# EasyEDA Pro project ORECON_REV1.0.eprj

# Schematic 0:Main
Create Date: 2024-05-21; Page Name: P1; Project Name: ORECON; Schematic Name: 0:Main; Update Date: 2024-05-22; Add into BOM: yes; Convert to PCB: yes
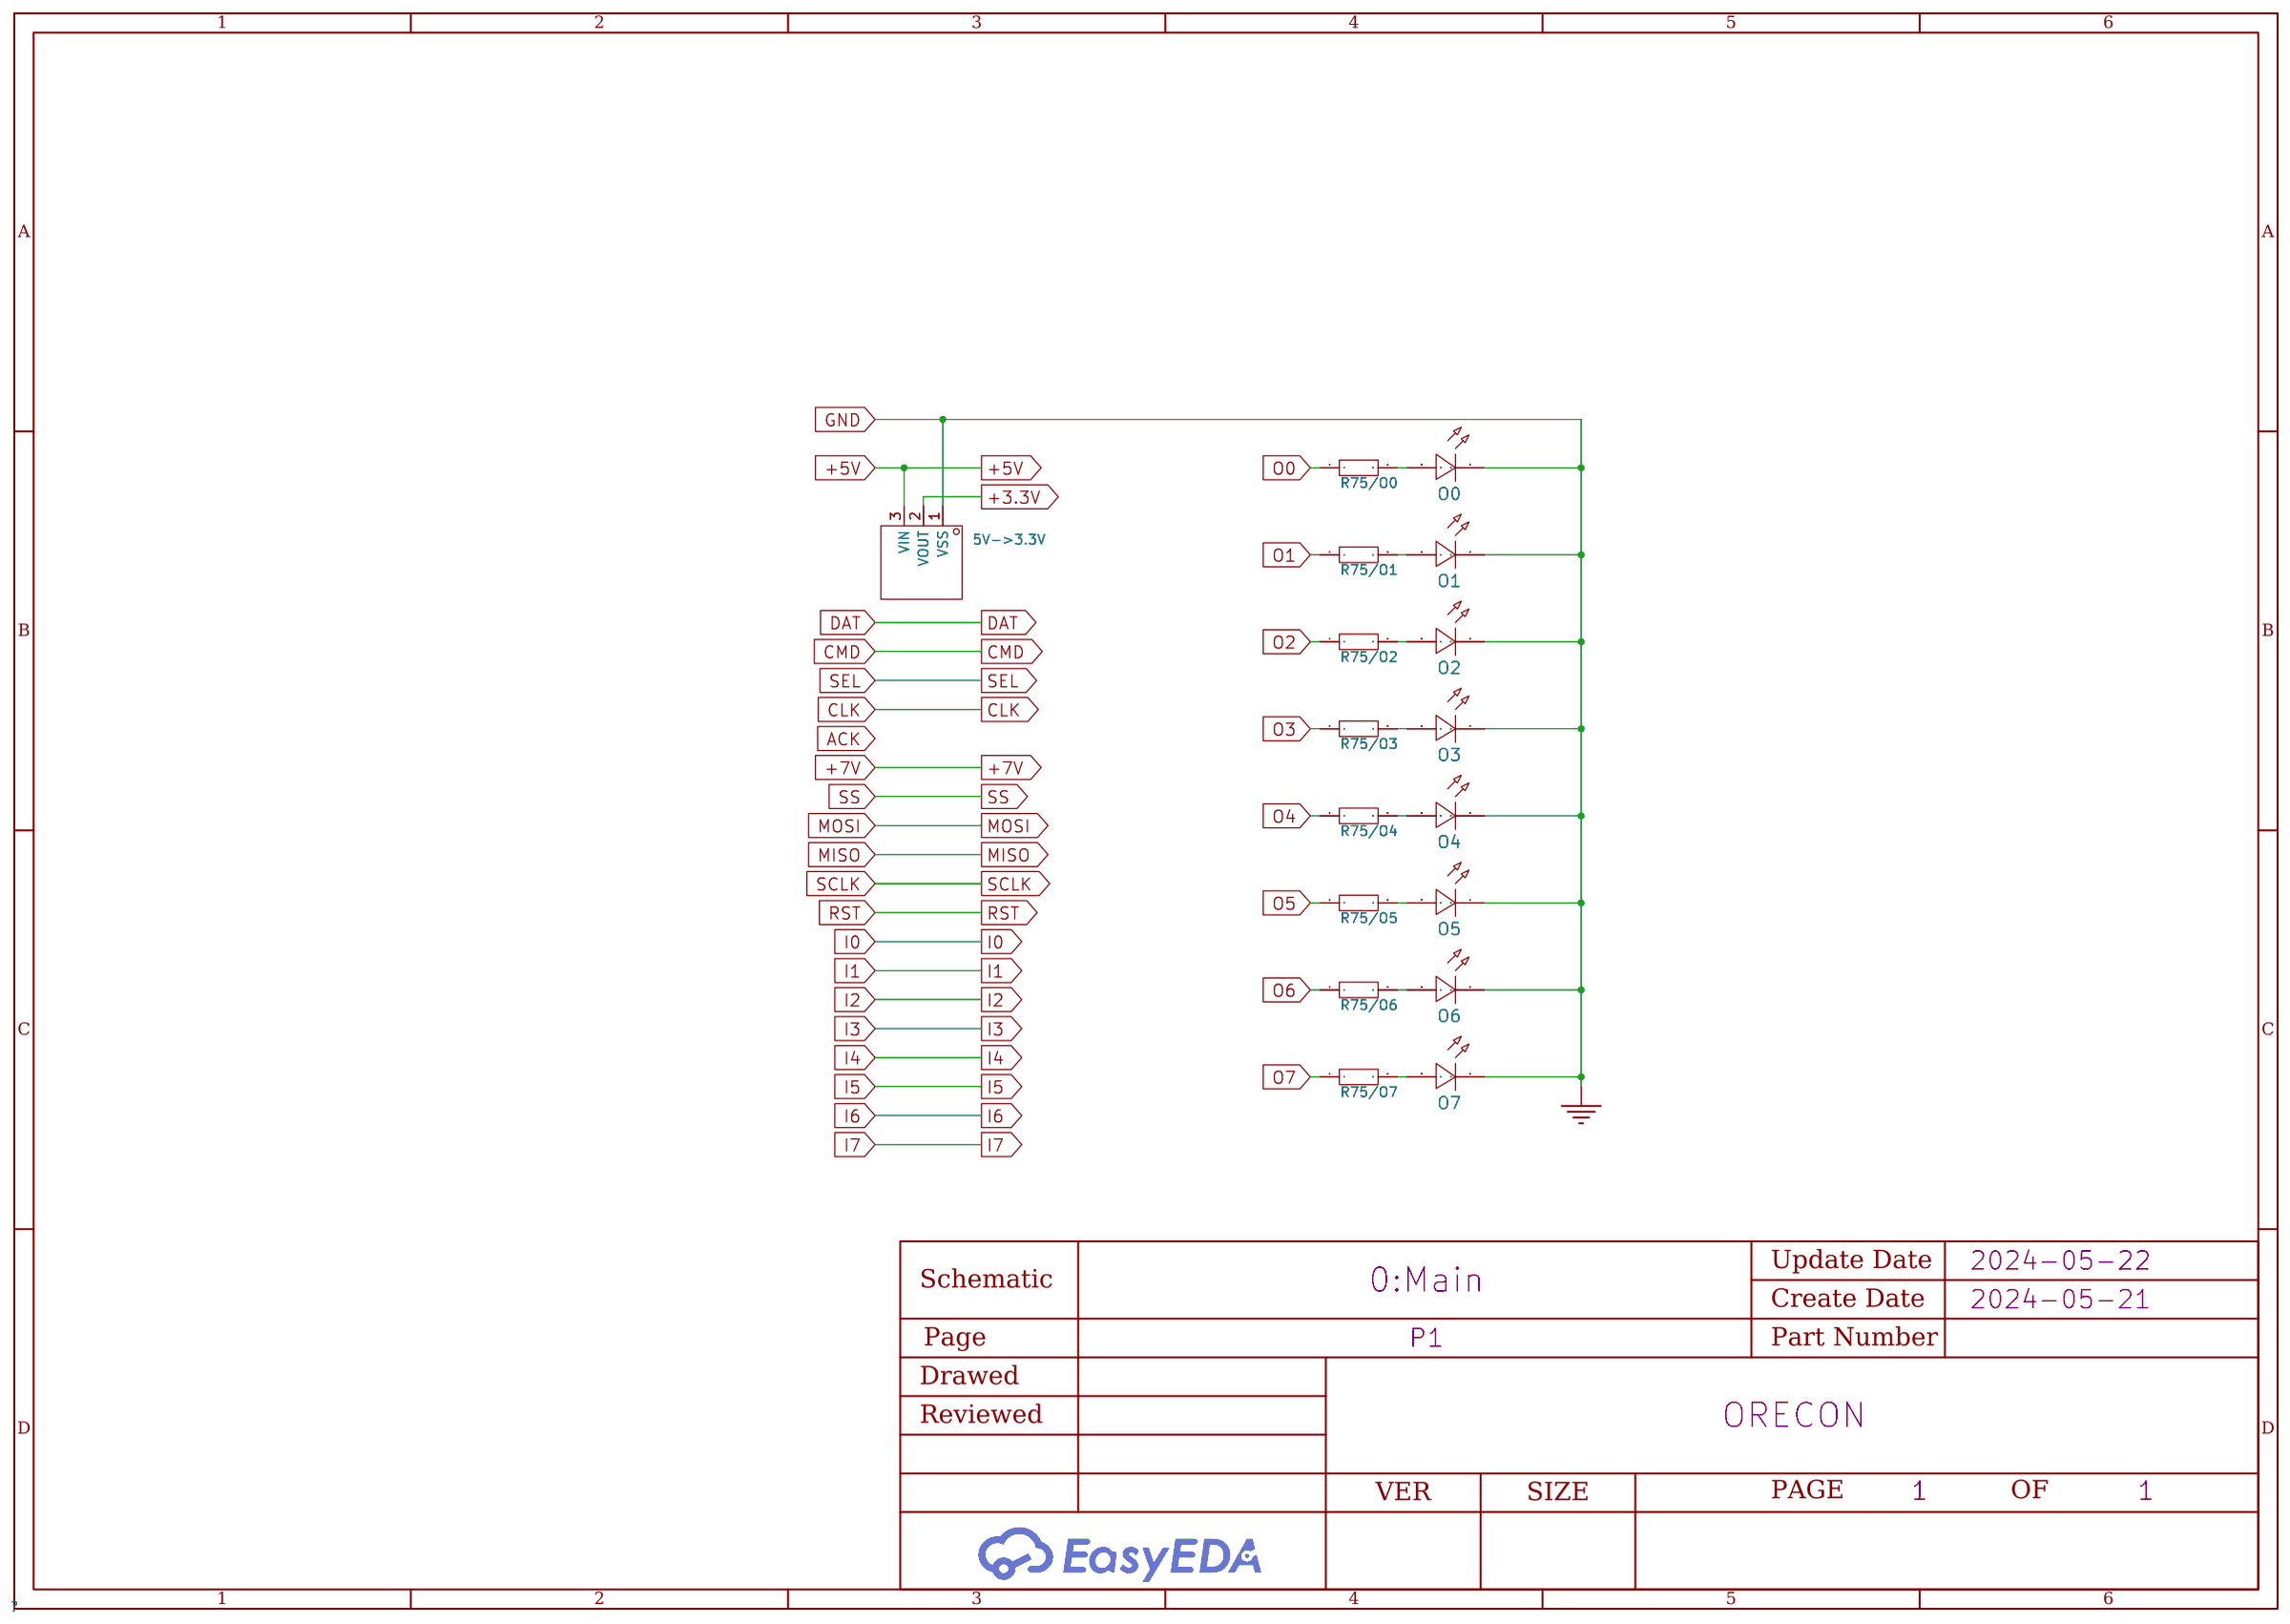
[diagram p0: schematic sheet]

## Parts
5V->3.3V  -  [SOT-23-3_L2.9-W1.6-P1.90-LS2.8-BR]
O0  -  [LED0402-RD_GREEN]
O1  -  [LED0402-RD_GREEN]
O2  -  [LED0402-RD_GREEN]
O3  -  [LED0402-RD_GREEN]
O4  -  [LED0402-RD_GREEN]
O5  -  [LED0402-RD_GREEN]
O6  -  [LED0402-RD_GREEN]
O7  -  [LED0402-RD_GREEN]
R75/O0  75Ω  [R0402]
R75/O1  75Ω  [R0402]
R75/O2  75Ω  [R0402]
R75/O3  75Ω  [R0402]
R75/O4  75Ω  [R0402]
R75/O5  75Ω  [R0402]
R75/O6  75Ω  [R0402]
R75/O7  75Ω  [R0402]

## Library data of the parts
5V->3.3V = ME6209A33M3G: Output Type: Output Polarity:Positive Number of Outputs:1 Maximum Input Voltage:18V Output Voltage:3.3V~3.3V Output Voltage:3.3V~3.3V Dropout Voltage:80mV@(40mA) Output Current:250mA Power Supply Rejection Ratio (PRSS):-; LCSC Part Name: Vin=18V Vout=3.3V 250mA; Supplier Part: C83508; Manufacturer: MICRONE(南京微盟); Supplier Footprint: SOT-23-3L; JLCPCB Part Class: Extended Part; Datasheet: https://atta.szlcsc.com/upload/public/pdf/source/20161212/1481539101152.pdf; Supplier: LCSC; Output Polarity: Positive; Number of Outputs: 1; Maximum Input Voltage: 18V; Output Voltage: 3.3V~3.3V; Dropout Voltage: 80mV@(40mA); Output Current: 250mA
O0-O7 = LED_0402-R: Emitted Color:红灯; Supplier Footprint: 0402; Supplier Part: C71911; JLCPCB Part Class: Extended Part; Emitted Color: 红灯
R75/O0-R75/O7 = 0402WGF750JTCE: Power(Watts): Tolerance: Temperature Coefficient: Temperature Coefficient: Resistance: Overload Voltage (Max): Operating Temperature Range: Operating Temperature Range:; LCSC Part Name: 75Ω ±1%; Supplier Part: C25133; Manufacturer: UNI-ROYAL(厚声); Supplier Footprint: 0402; JLCPCB Part Class: Basic Part; Datasheet: https://atta.szlcsc.com/upload/public/pdf/source/20170920/C25133_1505901226826982763.pdf; Supplier: LCSC; Tolerance: ±1%; Temperature Coefficient: ±100ppm/℃; Operating Temperature Range: -55℃~+155℃; Type: Thick Film Resistors

## Nets
+3.3V: 5V->3.3V.2(VOUT)
+5V: 5V->3.3V.3(VIN)
GND: 5V->3.3V.1(VSS) O0.1(C) O1.1(C) O2.1(C) O3.1(C) O4.1(C) O5.1(C) O6.1(C) O7.1(C)
O0: R75/O0.1
O1: R75/O1.1
O2: R75/O2.1
O3: R75/O3.1
O4: R75/O4.1
O5: R75/O5.1
O6: R75/O6.1
O7: R75/O7.1
$1N889: O0.2(A) R75/O0.2
$1N1284: O1.2(A) R75/O1.2
$1N1447: O2.2(A) R75/O2.2
$1N1536: O3.2(A) R75/O3.2
$1N1627: O4.2(A) R75/O4.2
$1N1720: O5.2(A) R75/O5.2
$1N1815: O6.2(A) R75/O6.2
$1N1912: O7.2(A) R75/O7.2

# Schematic 1:Sub - PS Controller
Create Date: 2024-05-21; Page Name: P1.1:Sub - PS Controller; Project Name: ORECON; Schematic Name: 1:Sub - PS Controller; Update Date: 2024-05-22; Add into BOM: yes; Convert to PCB: yes
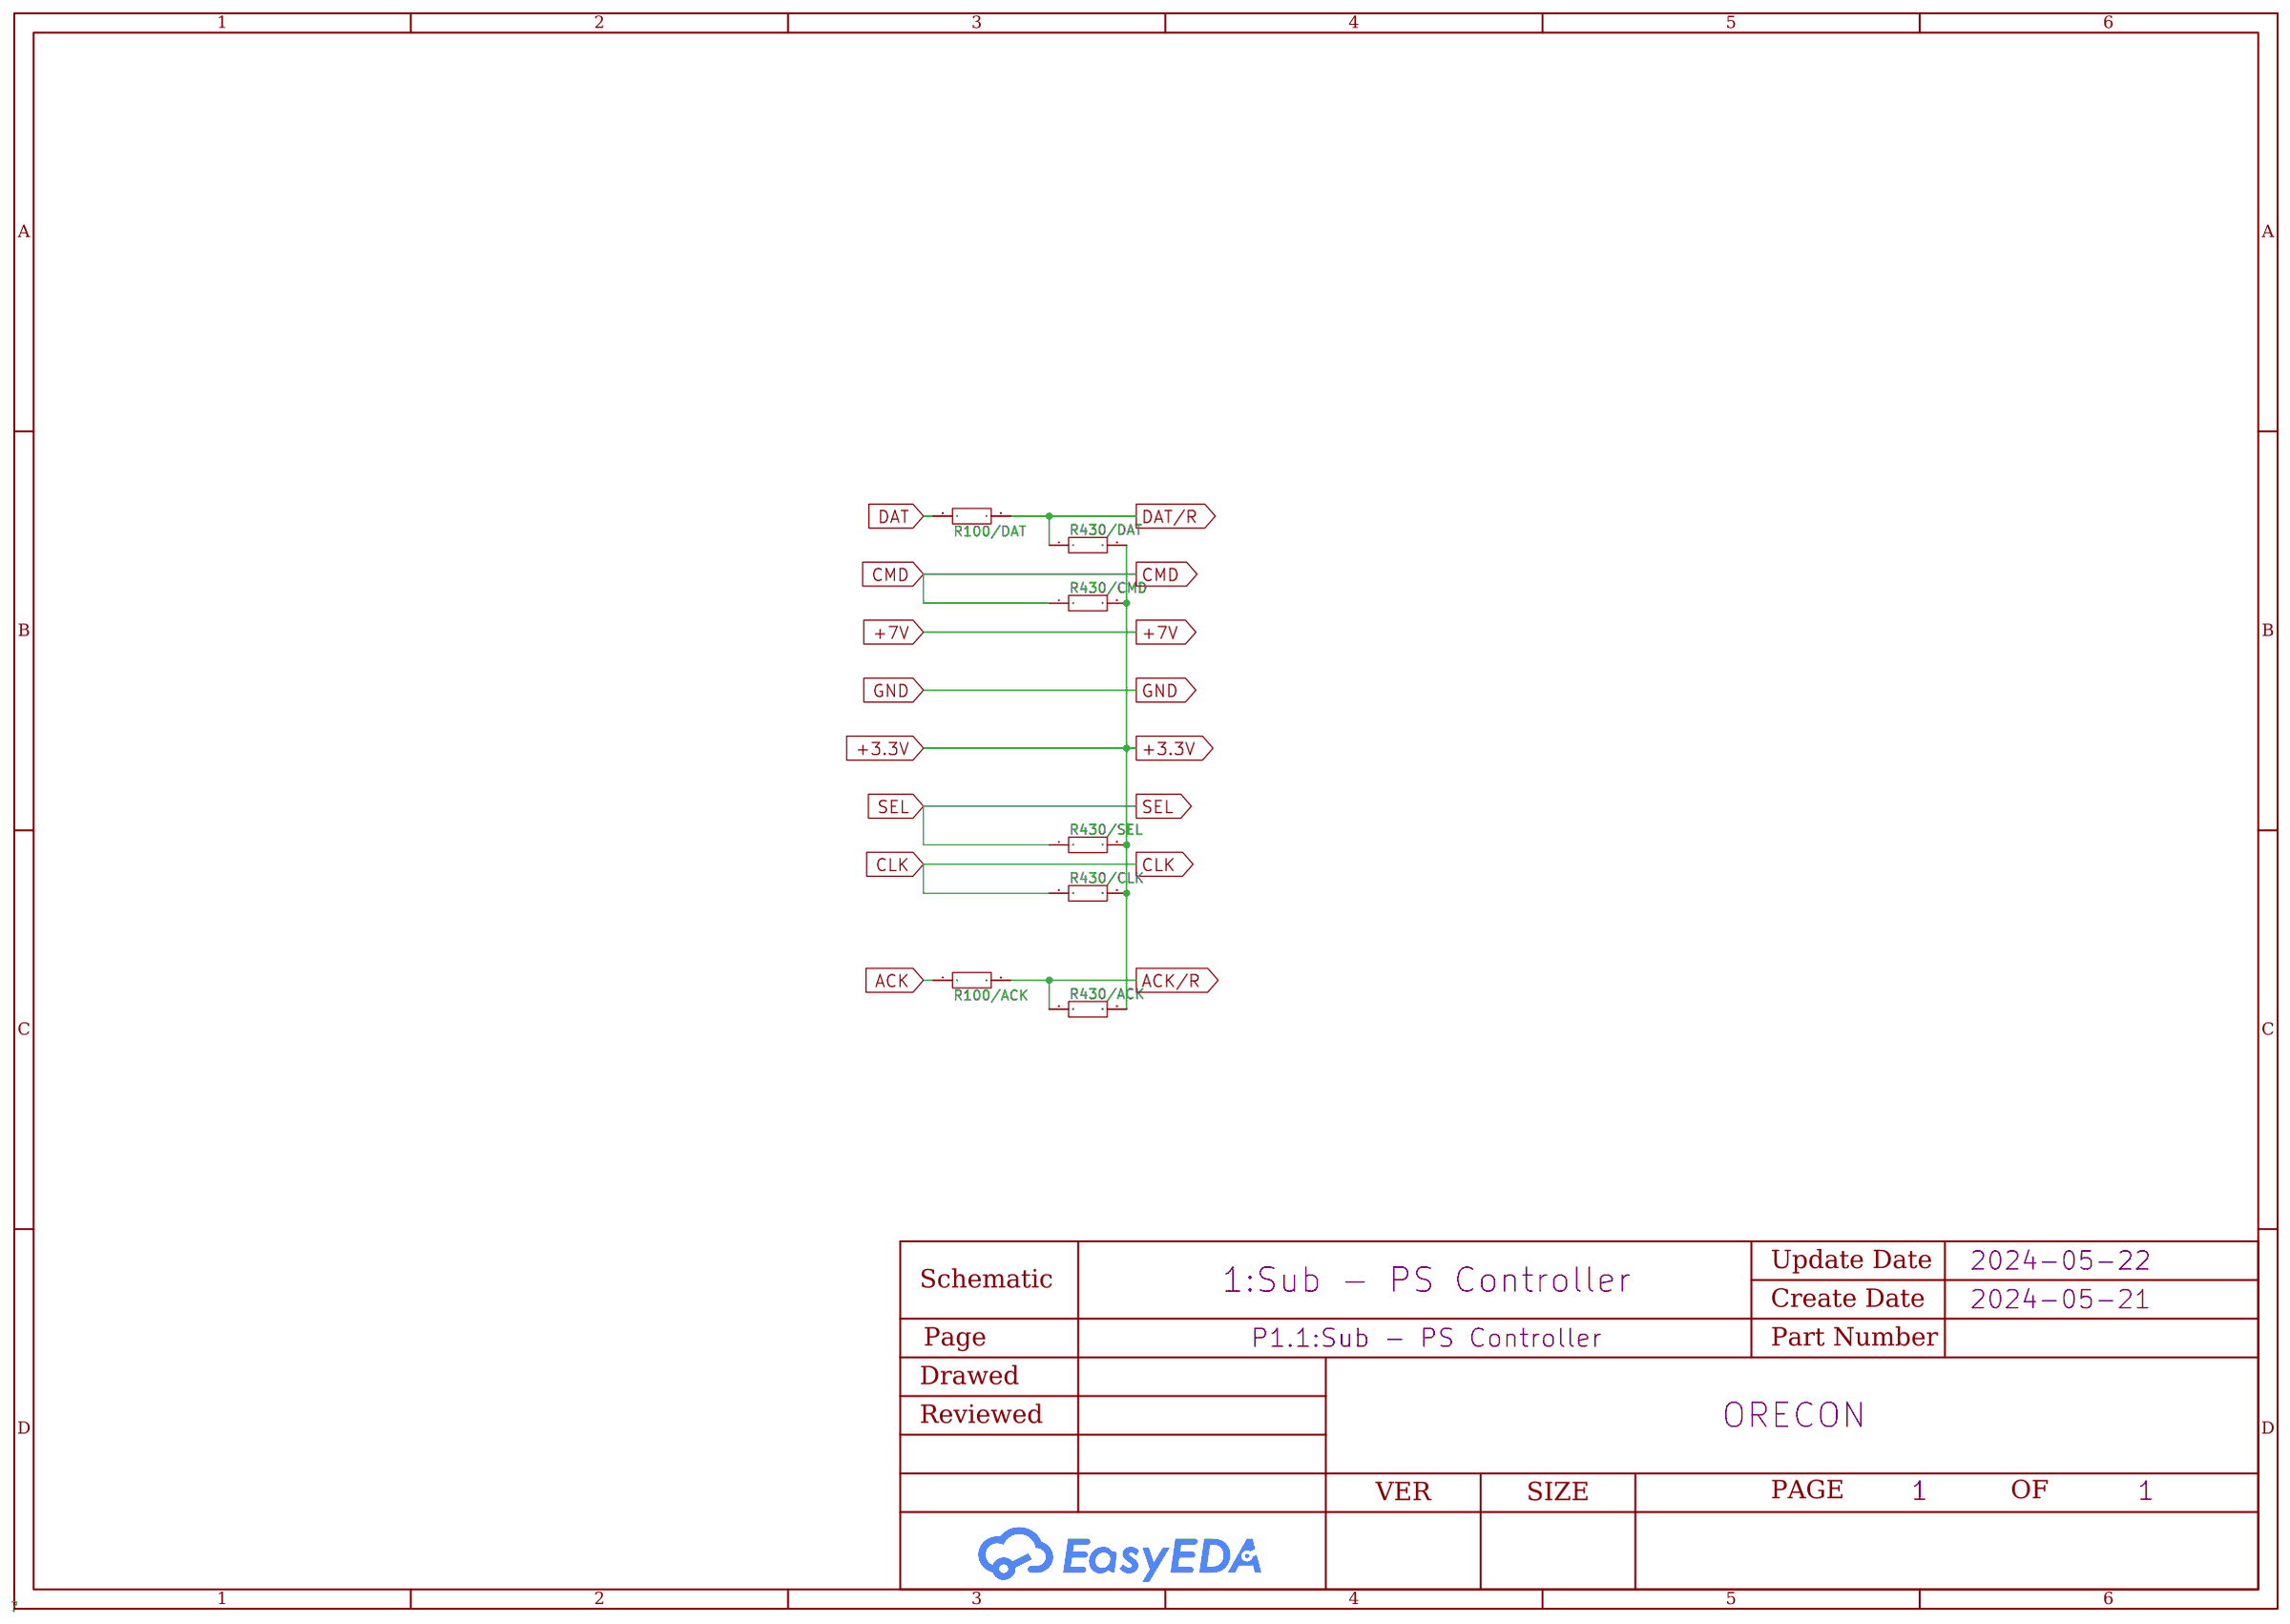
[diagram p1: schematic sheet]

## Parts
R100/ACK  100Ω  [R0402]
R100/DAT  100Ω  [R0402]
R430/ACK  430Ω  [R0402]
R430/CLK  430Ω  [R0402]
R430/CMD  430Ω  [R0402]
R430/DAT  430Ω  [R0402]
R430/SEL  430Ω  [R0402]

## Library data of the parts
R100/ACK R100/DAT = 0402WGF1000TCE: Type:Thick Film Resistors Resistance: Tolerance:±1% Tolerance:±1% Power(Watts): Temperature Coefficient: Temperature Coefficient: Overload Voltage (Max): Operating Temperature Range: Operating Temperature Range:; LCSC Part Name: 100Ω ±1% 1/16W; Supplier Part: C25076; Manufacturer: UNI-ROYAL(厚声); Supplier Footprint: 0402; JLCPCB Part Class: Basic Part; Datasheet: https://atta.szlcsc.com/upload/public/pdf/source/20200306/C422600_1E6D84923E4A46A82E41ADD87F860B5C.pdf; Supplier: LCSC; Type: Thick Film Resistors; Tolerance: ±1%; Check: true
R430/ACK R430/CLK R430/CMD R430/DAT R430/SEL = 0402WGF4300TCE: Type:Thick Film Resistors Resistance: Tolerance:±1% Tolerance:±1% Power(Watts): Temperature Coefficient:±100ppm/℃ Temperature Coefficient:±100ppm/℃ Overload Voltage (Max):; LCSC Part Name: 430Ω ±1% 62.5mW; Supplier Part: C36356; Manufacturer: UNI-ROYAL(厚声); Supplier Footprint: 0402; JLCPCB Part Class: Extended Part; Datasheet: https://atta.szlcsc.com/upload/public/pdf/source/20200306/C422600_1E6D84923E4A46A82E41ADD87F860B5C.pdf; Supplier: LCSC; Type: Thick Film Resistors; Tolerance: ±1%; Temperature Coefficient: ±100ppm/℃; Check: true

## Nets
+3.3V: R430/ACK.2 R430/CLK.2 R430/CMD.2 R430/DAT.2 R430/SEL.2
ACK: R100/ACK.1
ACK/R: R100/ACK.2 R430/ACK.1
CLK: R430/CLK.1
CMD: R430/CMD.1
DAT: R100/DAT.1
DAT/R: R100/DAT.2 R430/DAT.1
SEL: R430/SEL.1

# Board 0:Main
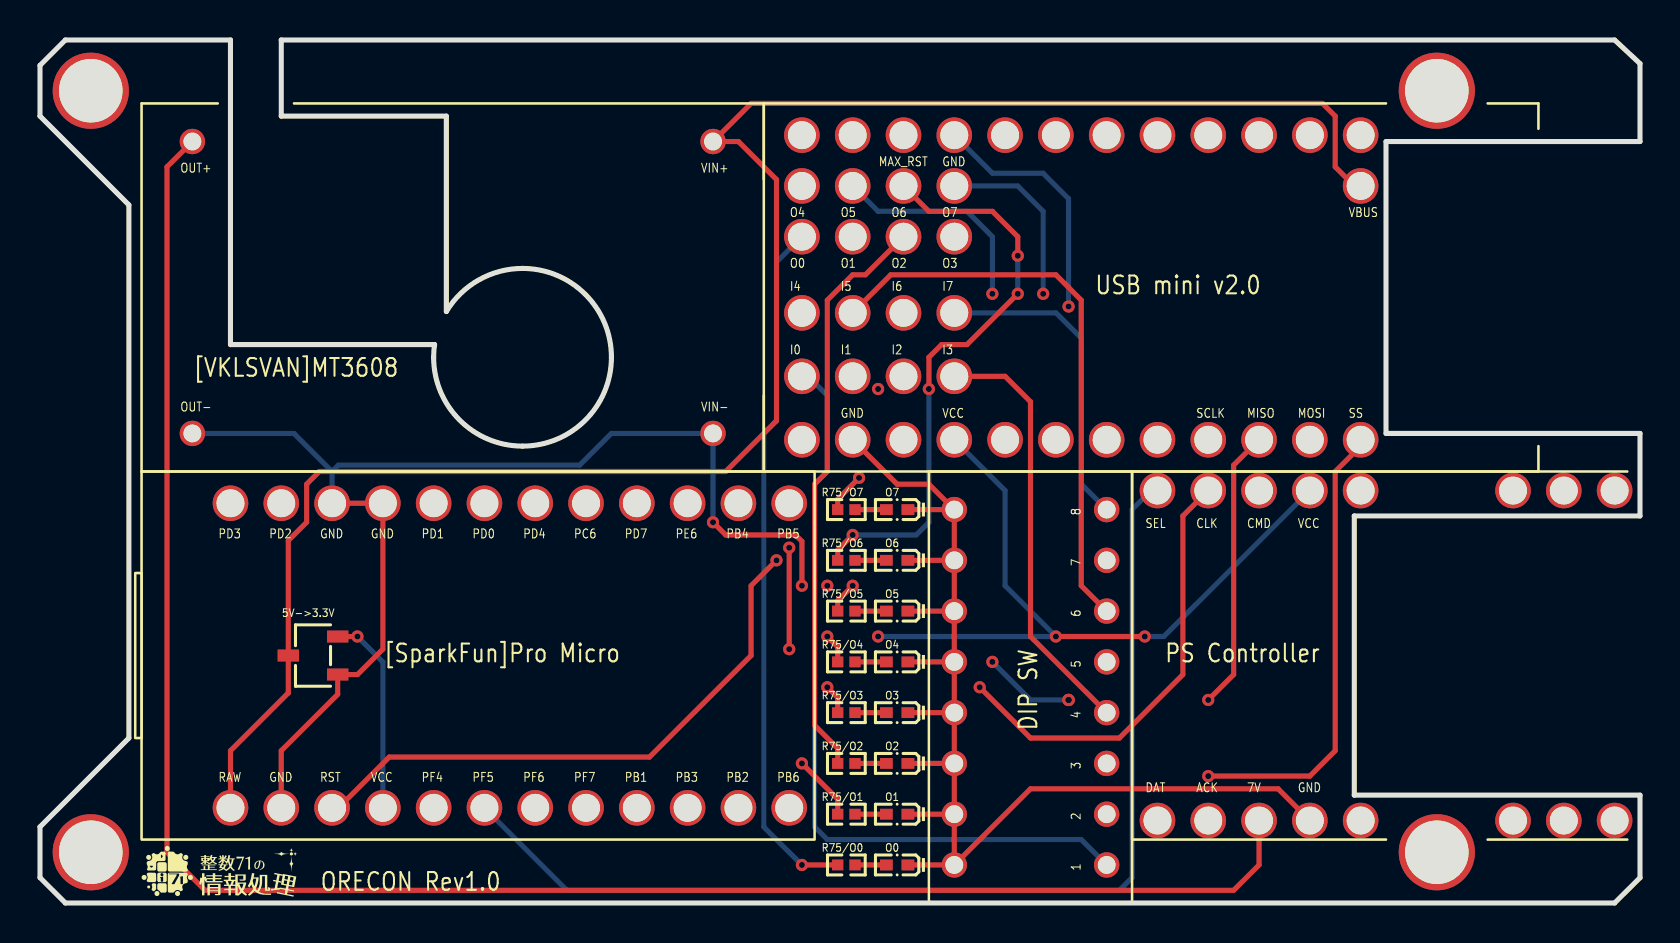
[diagram p2: board, top side]
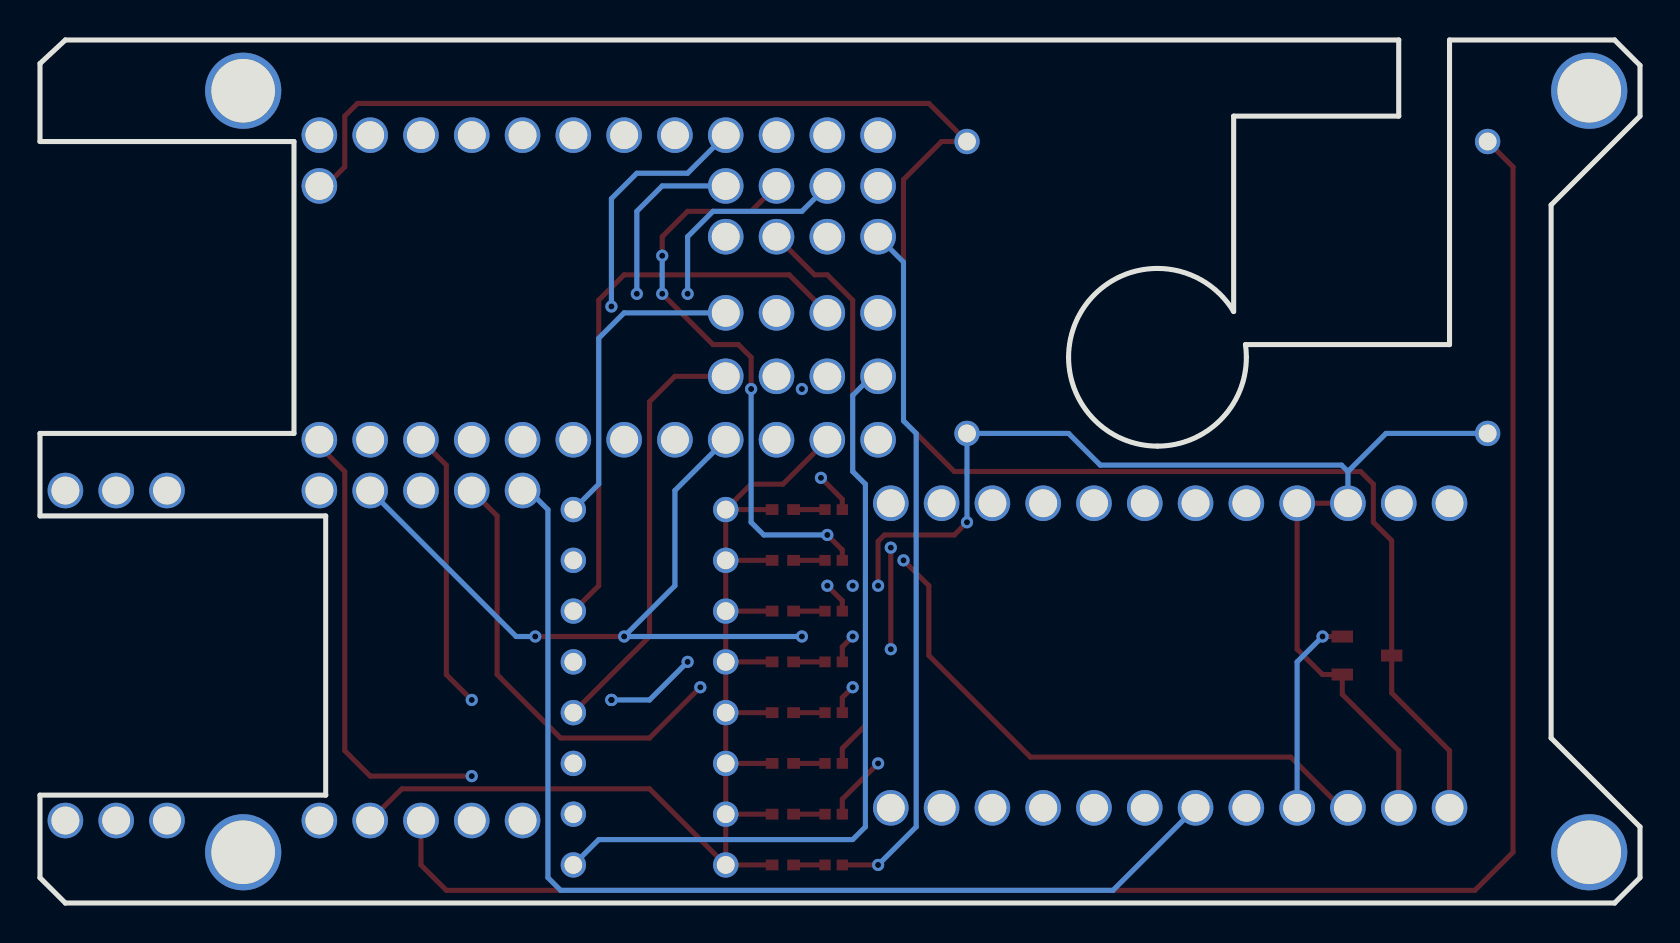
[diagram p3: board, bottom side, seen from below]

Outline 80.01 x 43.18 mm; copper layers: Top Layer, Inner1, Inner2, Bottom Layer. Coordinates in mm from the lower left corner of the outline.
Outline path: 0,41.91 1.27,43.18 9.53,43.18 9.53,27.94 19.73,27.94 arc(19.7,27.62) 19.69,27.31 arc(20.99,24.16) 24.13,22.86 arc(27.27,24.16) 28.58,27.31 arc(27.27,30.45) 24.13,31.75 arc(21.94,31.17) 20.32,29.59 20.32,39.37 12.07,39.37 12.07,43.18 78.74,43.18 80.01,42 80.01,38.1 67.31,38.1 67.31,23.5 80.01,23.5 80.01,19.37 65.72,19.37 65.72,5.4 80.01,5.4 80.01,1.27 78.74,0 1.27,0 0,1.27 0,3.81 4.45,8.26 4.45,34.92 0,39.37 0,41.91
Stack: Top Layer 0.035mm 外层铜厚1oz / Dielectric1 0.2104mm 7628 RC49% 8.6mil / Inner1 0.0152mm 内层铜厚 / Dielectric2 1.065mm 1.1mm H/HOZ 含铜 / Inner2 0.0152mm 内层铜厚 / Dielectric3 0.2104mm 7628 RC49% 8.6mil / Bottom Layer 0.035mm 外层铜厚1oz

## Design rules (mm)
template: Custom Config
spacing copperThickness1oz (default): track to track 0.102, other pairs 0.152 to 0.3
spacing copperThickness2oz: track to track 0.203, other pairs 0.152 to 0.3
track width copperThickness1oz (default): min 0.127, default 0.254, max 2.54
track width copperThickness2oz: min 0.203, default 0.254, max 2.54
differential pair differentialPair (default): width min 0.127, default 0.254, max 2.54; gap min 0.152, default 0.152
via viaSize (default): diameter min 0.5, default 0.61, max 10; hole min 0.3, default 0.305, max 6.299

## Placement (name value [footprint] x y rotation side)
5V->3.3V  -  [SOT-23-3_L2.9-W1.6-P1.90-LS2.8-BR]  13.65 12.38 0 top
NOREF  -  [Pad_e19]  45.72 4.45 0 top
NOREF#2  -  [Pad_e14]  53.34 9.53 0 top
NOREF#3  -  [Pad_e52]  33.66 38.1 0 top
NOREF#4  -  [Pad_e585]  34.93 20 180 top
NOREF#5  -  [Pad_e187]  69.85 2.54 180 top
NOREF#6  -  [Pad_e927]  58.42 23.18 0 top
NOREF#7  -  [Pad_e616]  78.74 20.64 0 top
NOREF#8  -  [Pad_e944]  45.72 38.42 0 top
NOREF#9  -  [Pad_e28]  45.72 12.06 0 top
NOREF#10  -  [Pad_e569]  9.53 20 180 top
NOREF#11  -  [Pad_e582]  32.39 20 180 top
NOREF#12  -  [Pad_e567]  12.07 4.76 180 top
NOREF#13  -  [Pad_e934]  50.8 23.18 0 top
NOREF#14  -  [Pad_e933]  38.1 23.18 0 top
NOREF#15  -  [Pad_e948]  48.26 38.42 0 top
NOREF#16  -  [Pad_e999]  45.72 29.53 0 top
NOREF#17  -  [Pad_e998]  43.18 29.53 0 top
NOREF#18  -  [Pad_e576]  22.22 4.76 180 top
NOREF#19  -  [Pad_e10]  53.34 19.69 0 top
NOREF#20  -  [Pad_e17]  53.34 1.91 0 top
NOREF#21  -  [Pad_e932]  40.64 23.18 0 top
NOREF#22  -  [Pad_e946]  40.64 38.42 0 top
NOREF#23  -  [Pad_e589]  24.77 20 180 top
NOREF#24  -  [Pad_e566]  9.53 4.76 180 top
NOREF#25  -  [Pad_e976]  40.64 35.88 0 top
NOREF#26  -  [Pad_e13]  53.34 12.06 0 top
NOREF#27  -  [Pad_e943]  53.34 38.42 0 top
NOREF#28  -  [Pad_e945]  43.18 38.42 0 top
NOREF#29  -  [Pad_e997]  40.64 29.53 0 top
NOREF#30  -  [Pad_e931]  43.18 23.18 0 top
NOREF#31  -  [Pad_e584]  37.47 4.76 180 top
NOREF#32  -  [Pad_e583]  34.93 4.76 180 top
NOREF#33  -  [Pad_e938]  66.04 38.42 0 top
NOREF#34  -  [Pad_e440]  2.54 40.64 180 top
NOREF#35  -  [Pad_e622]  76.2 20.64 0 top
NOREF#36  -  [Pad_e12]  53.34 14.61 0 top
NOREF#37  -  [Pad_e939]  63.5 38.42 0 top
NOREF#38  -  [Pad_e928]  55.88 23.18 0 top
NOREF#39  -  [Pad_e454]  2.54 2.54 180 top
NOREF#40  -  [Pad_e378]  60.96 20.64 0 top
NOREF#41  -  [Pad_e31]  45.72 17.15 0 top
NOREF#42  -  [Pad_e573]  14.61 20 180 top
NOREF#43  -  [Pad_e16]  53.34 4.45 0 top
NOREF#44  -  [Pad_e578]  22.22 20 180 top
NOREF#45  -  [Pad_e379]  58.42 20.64 0 top
NOREF#46  -  [Pad_e20]  45.72 6.98 0 top
NOREF#47  -  [Pad_e30]  45.72 14.61 0 top
NOREF#48  -  [Pad_e2]  33.66 23.5 0 top
NOREF#49  -  [Pad_e382]  60.96 4.13 0 top
NOREF#50  -  [Pad_e982]  45.72 33.34 0 top
NOREF#51  -  [Pad_e924]  66.04 23.18 0 top
NOREF#52  -  [Pad_e940]  60.96 38.42 0 top
NOREF#53  -  [Pad_e574]  17.15 20 180 top
NOREF#54  -  [Pad_e579]  29.84 4.76 180 top
NOREF#55  -  [Pad_e974]  45.72 35.88 0 top
NOREF#56  -  [Pad_e930]  45.72 23.18 0 top
NOREF#57  -  [Pad_e975]  43.18 35.88 0 top
NOREF#58  -  [Pad_e1142]  66.04 35.88 0 top
NOREF#59  -  [Pad_e990]  45.72 26.35 0 top
NOREF#60  -  [Pad_e588]  27.31 4.76 180 top
NOREF#61  -  [Pad_e991]  43.18 26.35 0 top
NOREF#62  -  [Pad_e575]  19.69 4.76 180 top
NOREF#63  -  [Pad_e377]  63.5 20.64 0 top
NOREF#64  -  [Pad_e386]  73.66 4.13 0 top
NOREF#65  -  [Pad_e11]  53.34 17.15 0 top
NOREF#66  -  [Pad_e1003]  38.1 29.53 0 top
NOREF#67  -  [Pad_e380]  55.88 20.64 0 top
NOREF#68  -  [Pad_e24]  45.72 9.53 0 top
NOREF#69  -  [Pad_e614]  78.74 4.13 0 top
NOREF#70  -  [Pad_e941]  58.42 38.42 0 top
NOREF#71  -  [Pad_e577]  19.69 20 180 top
NOREF#72  -  [Pad_e989]  38.1 26.35 0 top
NOREF#73  -  [Pad_e571]  14.61 4.76 180 top
NOREF#74  -  [Pad_e981]  38.1 33.34 0 top
NOREF#75  -  [Pad_e15]  53.34 6.98 0 top
NOREF#76  -  [Pad_e581]  29.84 20 180 top
NOREF#77  -  [Pad_e992]  40.64 26.35 0 top
NOREF#78  -  [Pad_e185]  69.85 40.64 180 top
NOREF#79  -  [Pad_e9]  7.62 23.5 0 top
NOREF#80  -  [Pad_e925]  63.5 23.18 0 top
NOREF#81  -  [Pad_e383]  58.42 4.13 0 top
NOREF#82  -  [Pad_e926]  60.96 23.18 0 top
NOREF#83  -  [Pad_e984]  40.64 33.34 0 top
NOREF#84  -  [Pad_e572]  17.15 4.76 180 top
NOREF#85  -  [Pad_e570]  12.07 20 180 top
NOREF#86  -  [Pad_e621]  73.66 20.64 0 top
NOREF#87  -  [Pad_e973]  38.1 35.88 0 top
NOREF#88  -  [Pad_e5]  7.62 38.1 0 top
NOREF#89  -  [Pad_e34]  45.72 19.69 0 top
NOREF#90  -  [Pad_e618]  66.04 20.64 0 top
NOREF#91  -  [Pad_e18]  45.72 1.91 0 top
NOREF#92  -  [Pad_e587]  24.77 4.76 180 top
NOREF#93  -  [Pad_e935]  48.26 23.18 0 top
NOREF#94  -  [Pad_e947]  50.8 38.42 0 top
NOREF#95  -  [Pad_e580]  32.39 4.76 180 top
NOREF#96  -  [Pad_e942]  55.88 38.42 0 top
NOREF#97  -  [Pad_e384]  55.88 4.13 0 top
NOREF#98  -  [Pad_e590]  27.31 20 180 top
NOREF#99  -  [Pad_e983]  43.18 33.34 0 top
NOREF#100  -  [Pad_e389]  66.04 4.13 0 top
NOREF#101  -  [Pad_e381]  63.5 4.13 0 top
NOREF#102  -  [Pad_e586]  37.47 20 180 top
NOREF#103  -  [Pad_e937]  38.1 38.42 0 top
NOREF#104  -  [Pad_e613]  76.2 4.13 0 top
NOREF#105  -  [Pad_e929]  53.34 23.18 0 top
O0  -  [LED0402-RD_GREEN]  42.86 1.91 180 top
O1  -  [LED0402-RD_GREEN]  42.86 4.45 180 top
O2  -  [LED0402-RD_GREEN]  42.86 6.98 180 top
O3  -  [LED0402-RD_GREEN]  42.86 9.53 180 top
O4  -  [LED0402-RD_GREEN]  42.86 12.06 180 top
O5  -  [LED0402-RD_GREEN]  42.86 14.61 180 top
O6  -  [LED0402-RD_GREEN]  42.86 17.15 180 top
O7  -  [LED0402-RD_GREEN]  42.86 19.69 180 top
R75/O0  75Ω  [R0402]  40.32 1.91 0 top
R75/O1  75Ω  [R0402]  40.32 4.45 0 top
R75/O2  75Ω  [R0402]  40.32 6.98 0 top
R75/O3  75Ω  [R0402]  40.32 9.53 0 top
R75/O4  75Ω  [R0402]  40.32 12.06 0 top
R75/O5  75Ω  [R0402]  40.32 14.61 0 top
R75/O6  75Ω  [R0402]  40.32 17.15 0 top
R75/O7  75Ω  [R0402]  40.32 19.69 0 top

## Footprints (pads in the part's own frame, mm; a bottom-side part is the same pattern mirrored in y, then rotated)
LED0402-RD_GREEN
  rect 0.637x0.541 smd: 1(-0.538,0) 2(0.538,0)
Pad_e2
  round 1.27 hole 0.889: VINM(0,0)
Pad_e5
  round 1.27 hole 0.889: OUTP(0,0)
Pad_e9
  round 1.27 hole 0.889: OUTM(0,0)
Pad_e10
  round 1.27 hole 0.889: I7(0,0)
Pad_e11
  round 1.27 hole 0.889: I6(0,0)
Pad_e12
  round 1.27 hole 0.889: I5(0,0)
Pad_e13
  round 1.27 hole 0.889: I4(0,0)
Pad_e14
  round 1.27 hole 0.889: I3(0,0)
Pad_e15
  round 1.27 hole 0.889: I2(0,0)
Pad_e16
  round 1.27 hole 0.889: I1(0,0)
Pad_e17
  round 1.27 hole 0.889: I0(0,0)
Pad_e18
  round 1.27 hole 0.889: GND(0,0)
Pad_e19
  round 1.27 hole 0.889: GND(0,0)
Pad_e20
  round 1.27 hole 0.889: GND(0,0)
Pad_e24
  round 1.27 hole 0.889: GND(0,0)
Pad_e28
  round 1.27 hole 0.889: GND(0,0)
Pad_e30
  round 1.27 hole 0.889: GND(0,0)
Pad_e31
  round 1.27 hole 0.889: GND(0,0)
Pad_e34
  round 1.27 hole 0.889: GND(0,0)
Pad_e52
  round 1.27 hole 0.889: VINP(0,0)
Pad_e185
  round 3.81 hole 3.175: NONE(0,0)
Pad_e187
  round 3.81 hole 3.175: NONE(0,0)
Pad_e377
  round 1.778 hole 1.397: VCC(0,0)
Pad_e378
  round 1.778 hole 1.397: CMD(0,0)
Pad_e379
  round 1.778 hole 1.397: CLK(0,0)
Pad_e380
  round 1.778 hole 1.397: SEL(0,0)
Pad_e381
  round 1.778 hole 1.397: GND(0,0)
Pad_e382
  round 1.778 hole 1.397: 7V(0,0)
Pad_e383
  round 1.778 hole 1.397: ACK(0,0)
Pad_e384
  round 1.778 hole 1.397: DAT(0,0)
Pad_e386
  round 1.778 hole 1.397: NONE(0,0)
Pad_e389
  round 1.778 hole 1.397: NONE(0,0)
Pad_e440
  round 3.81 hole 3.175: NONE(0,0)
Pad_e454
  round 3.81 hole 3.175: NONE(0,0)
Pad_e566
  round 1.778 hole 1.397: RAW(0,0)
Pad_e567
  round 1.778 hole 1.397: GND(0,0)
Pad_e569
  round 1.778 hole 1.397: PD3(0,0)
Pad_e570
  round 1.778 hole 1.397: PD2(0,0)
Pad_e571
  round 1.778 hole 1.397: RST(0,0)
Pad_e572
  round 1.778 hole 1.397: VCC(0,0)
Pad_e573
  round 1.778 hole 1.397: GND(0,0)
Pad_e574
  round 1.778 hole 1.397: GND(0,0)
Pad_e575
  round 1.778 hole 1.397: PF4(0,0)
Pad_e576
  round 1.778 hole 1.397: PF5(0,0)
Pad_e577
  round 1.778 hole 1.397: PD1(0,0)
Pad_e578
  round 1.778 hole 1.397: PD0(0,0)
Pad_e579
  round 1.778 hole 1.397: SCLK(0,0)
Pad_e580
  round 1.778 hole 1.397: MISO(0,0)
Pad_e581
  round 1.778 hole 1.397: PD7(0,0)
Pad_e582
  round 1.778 hole 1.397: PE6(0,0)
Pad_e583
  round 1.778 hole 1.397: MOSI(0,0)
Pad_e584
  round 1.778 hole 1.397: SS(0,0)
Pad_e585
  round 1.778 hole 1.397: PB4(0,0)
Pad_e586
  round 1.778 hole 1.397: PB5(0,0)
Pad_e587
  round 1.778 hole 1.397: PF6(0,0)
Pad_e588
  round 1.778 hole 1.397: PF7(0,0)
Pad_e589
  round 1.778 hole 1.397: PD4(0,0)
Pad_e590
  round 1.778 hole 1.397: PC6(0,0)
Pad_e613
  round 1.778 hole 1.397: NONE(0,0)
Pad_e614
  round 1.778 hole 1.397: NONE(0,0)
Pad_e616
  round 1.778 hole 1.397: NONE(0,0)
Pad_e618
  round 1.778 hole 1.397: NONE(0,0)
Pad_e621
  round 1.778 hole 1.397: NONE(0,0)
Pad_e622
  round 1.778 hole 1.397: NONE(0,0)
Pad_e924
  round 1.778 hole 1.397: SS(0,0)
Pad_e925
  round 1.778 hole 1.397: MOSI(0,0)
Pad_e926
  round 1.778 hole 1.397: MISO(0,0)
Pad_e927
  round 1.778 hole 1.397: SCLK(0,0)
Pad_e928
  round 1.778 hole 1.397: NONE(0,0)
Pad_e929
  round 1.778 hole 1.397: NONE(0,0)
Pad_e930
  round 1.778 hole 1.397: VCC(0,0)
Pad_e931
  round 1.778 hole 1.397: NONE(0,0)
Pad_e932
  round 1.778 hole 1.397: GND(0,0)
Pad_e933
  round 1.778 hole 1.397: NONE(0,0)
Pad_e934
  round 1.778 hole 1.397: NONE(0,0)
Pad_e935
  round 1.778 hole 1.397: NONE(0,0)
Pad_e937
  round 1.778 hole 1.397: NONE(0,0)
Pad_e938
  round 1.778 hole 1.397: NONE(0,0)
Pad_e939
  round 1.778 hole 1.397: NONE(0,0)
Pad_e940
  round 1.778 hole 1.397: NONE(0,0)
Pad_e941
  round 1.778 hole 1.397: NONE(0,0)
Pad_e942
  round 1.778 hole 1.397: NONE(0,0)
Pad_e943
  round 1.778 hole 1.397: NONE(0,0)
Pad_e944
  round 1.778 hole 1.397: PB1(0,0)
Pad_e945
  round 1.778 hole 1.397: MAXRST(0,0)
Pad_e946
  round 1.778 hole 1.397: NONE(0,0)
Pad_e947
  round 1.778 hole 1.397: NONE(0,0)
Pad_e948
  round 1.778 hole 1.397: NONE(0,0)
Pad_e973
  round 1.778 hole 1.397: O4(0,0)
Pad_e974
  round 1.778 hole 1.397: O7(0,0)
Pad_e975
  round 1.778 hole 1.397: O6(0,0)
Pad_e976
  round 1.778 hole 1.397: O5(0,0)
Pad_e981
  round 1.778 hole 1.397: O0(0,0)
Pad_e982
  round 1.778 hole 1.397: O3(0,0)
Pad_e983
  round 1.778 hole 1.397: O2(0,0)
Pad_e984
  round 1.778 hole 1.397: O1(0,0)
Pad_e989
  round 1.778 hole 1.397: I0(0,0)
Pad_e990
  round 1.778 hole 1.397: I3(0,0)
Pad_e991
  round 1.778 hole 1.397: I2(0,0)
Pad_e992
  round 1.778 hole 1.397: I1(0,0)
Pad_e997
  round 1.778 hole 1.397: I5(0,0)
Pad_e998
  round 1.778 hole 1.397: I6(0,0)
Pad_e999
  round 1.778 hole 1.397: I7(0,0)
Pad_e1003
  round 1.778 hole 1.397: I4(0,0)
Pad_e1142
  round 1.778 hole 1.397: VBUS(0,0)
R0402
  rect 0.566x0.54 smd: 1(-0.433,0) 2(0.433,0)
SOT-23-3_L2.9-W1.6-P1.90-LS2.8-BR
  rect 1.07x0.6 smd: 1(1.235,-0.95) 2(1.235,0.95) 3(-1.235,0)

## Nets
+3.3V: 5V->3.3V.2 NOREF#56.VCC NOREF#63.VCC NOREF#84.VCC
+5V: 5V->3.3V.3 NOREF#3.VINP NOREF#24.RAW NOREF#58.VBUS
+7V: NOREF#49.7V NOREF#88.OUTP
GND: 5V->3.3V.1 NOREF.GND NOREF#8.PB1 NOREF#9.GND NOREF#12.GND NOREF#21.GND NOREF#41.GND NOREF#42.GND NOREF#46.GND NOREF#47.GND NOREF#48.VINM NOREF#53.GND NOREF#68.GND NOREF#79.OUTM NOREF#89.GND NOREF#91.GND NOREF#101.GND O0.1 O1.1 O2.1 O3.1 O4.1 O5.1 O6.1 O7.1
ACK: NOREF#81.ACK
CLK: NOREF#45.CLK NOREF#62.PF4
CMD: NOREF#40.CMD NOREF#92.PF6
DAT: NOREF#60.PF7 NOREF#97.DAT
I0: NOREF#20.I0 NOREF#72.I0
I1: NOREF#43.I1 NOREF#77.I1
I2: NOREF#61.I2 NOREF#75.I2
I3: NOREF#2.I3 NOREF#59.I3
I4: NOREF#26.I4 NOREF#66.I4
I5: NOREF#29.I5 NOREF#36.I5
I6: NOREF#17.I6 NOREF#65.I6
I7: NOREF#16.I7 NOREF#19.I7
MISO: NOREF#82.MISO NOREF#95.MISO
MOSI: NOREF#32.MOSI NOREF#80.MOSI
O0: NOREF#74.O0 R75/O0.1
O1: NOREF#83.O1 R75/O1.1
O2: NOREF#99.O2 R75/O2.1
O3: NOREF#50.O3 R75/O3.1
O4: NOREF#87.O4 R75/O4.1
O5: NOREF#25.O5 R75/O5.1
O6: NOREF#57.O6 R75/O6.1
O7: NOREF#55.O7 R75/O7.1
RST: NOREF#28.MAXRST NOREF#73.RST
SCLK: NOREF#6.SCLK NOREF#54.SCLK
SEL: NOREF#18.PF5 NOREF#67.SEL
SS: NOREF#31.SS NOREF#51.SS
$1N889: O0.2 R75/O0.2
$1N1284: O1.2 R75/O1.2
$1N1447: O2.2 R75/O2.2
$1N1536: O3.2 R75/O3.2
$1N1627: O4.2 R75/O4.2
$1N1720: O5.2 R75/O5.2
$1N1815: O6.2 R75/O6.2
$1N1912: O7.2 R75/O7.2

Pads without a net: NOREF#4 PB4; NOREF#5 NONE; NOREF#7 NONE; NOREF#10 PD3; NOREF#11 PE6; NOREF#13 NONE; NOREF#14 NONE; NOREF#15 NONE; NOREF#22 NONE; NOREF#23 PD4; NOREF#27 NONE; NOREF#30 NONE; NOREF#33 NONE; NOREF#34 NONE; NOREF#35 NONE; NOREF#37 NONE; NOREF#38 NONE; NOREF#39 NONE; NOREF#44 PD0; NOREF#52 NONE; NOREF#64 NONE; NOREF#69 NONE; NOREF#70 NONE; NOREF#71 PD1; NOREF#76 PD7; NOREF#78 NONE; NOREF#85 PD2; NOREF#86 NONE; NOREF#90 NONE; NOREF#93 NONE; NOREF#94 NONE; NOREF#96 NONE; NOREF#98 PC6; NOREF#100 NONE; NOREF#102 PB5; NOREF#103 NONE; NOREF#104 NONE; NOREF#105 NONE

## Via types
v1: diameter 0.61, hole 0.305, Top Layer to Bottom Layer, 31 vias

## Routing (per net, layer and track width the routed paths; a pad name or vN(x,y) marks a point on that pad's centre or on a via; arc(x,y) is an arc through that point)
+3.3V: length 76
  Top Layer w0.254: 5V->3.3V.2 15.87,13.33 v1(15.88,13.34) ; v1(50.8,13.34) v1(55.25,13.34)
  Inner2 w0.254: v1(41.91,13.34) 41.91,13.3 40.67,12.06 39.37,12.06 38.1,13.34 37.15,13.34 30.48,6.67 19.05,6.67 NOREF#84.VCC
  Bottom Layer w0.254: v1(41.91,13.34) v1(50.8,13.34) 48.26,15.88 48.26,20.64 NOREF#56.VCC ; NOREF#63.VCC 56.2,13.34 v1(55.25,13.34) ; NOREF#84.VCC 17.15,12.06 v1(15.88,13.34)
+5V: length 95
  Top Layer w0.254: NOREF#58.VBUS 65.72,35.88 64.77,36.83 64.77,39.37 64.14,40.01 35.56,40.01 NOREF#3.VINP 34.93,38.1 36.83,36.2 36.83,24.13 34.29,21.59 13.97,21.59 13.34,20.95 13.34,19.05 12.42,18.13 5V->3.3V.3 12.42,10.51 9.53,7.62 NOREF#24.RAW
+7V: length 94.2
  Top Layer w0.254: NOREF#49.7V 60.96,1.91 59.69,0.63 8.26,0.63 6.35,2.54 6.35,36.83 NOREF#88.OUTP
GND: length 159.7
  Top Layer w0.254: NOREF#42.GND NOREF#53.GND 17.15,12.7 15.88,11.43 5V->3.3V.1 14.89,10.44 12.07,7.62 NOREF#12.GND ; NOREF#91.GND NOREF.GND ; NOREF#91.GND 49.53,5.72 61.91,5.72 NOREF#101.GND ; NOREF#91.GND O0.1 ; NOREF.GND O1.1 ; NOREF.GND NOREF#46.GND ; NOREF#68.GND O3.1 ; NOREF#68.GND NOREF#9.GND ; NOREF#68.GND NOREF#46.GND ; NOREF#47.GND NOREF#41.GND ; NOREF#47.GND O5.1 ; NOREF#47.GND NOREF#9.GND ; NOREF#41.GND NOREF#89.GND ; NOREF#41.GND O6.1 ; NOREF#9.GND O4.1 ; NOREF#46.GND O2.1 ; NOREF#89.GND 44.45,20.95 42.86,20.95 NOREF#21.GND ; NOREF#89.GND O7.1 ; v1(38.1,15.88) 38.1,18.1 37.78,18.42 34.29,18.42 v1(33.66,19.05)
  Inner2 w0.254: NOREF#89.GND 48.26,19.69 49.53,20.95 49.53,24.13 51.44,26.03 v1(51.44,29.84) ; v1(38.1,15.88) 39.37,14.61 41.28,14.61 42.55,15.88 44.45,15.88 NOREF#47.GND
  Bottom Layer w0.254: 14.61,21.59 12.7,23.5 NOREF#79.OUTM ; 14.61,21.59 NOREF#42.GND ; 14.61,21.59 14.92,21.91 26.99,21.91 28.58,23.5 NOREF#48.VINM v1(33.66,19.05) ; v1(51.44,29.84) 51.44,35.24 50.17,36.51 47.62,36.51 NOREF#8.PB1
CLK: length 52.1
  Top Layer w0.254: NOREF#45.CLK 57.15,19.37 57.15,11.43 53.97,8.26 49.53,8.26 v1(46.99,10.8)
  Inner2 w0.254: NOREF#62.PF4 20.96,6.03 30.48,6.03 33.97,9.53 39.05,9.53 40.32,10.8 v1(46.99,10.8)
CMD: length 56.4
  Inner2 w0.254: NOREF#92.PF6 28.89,0.63 58.42,0.63 59.69,1.91 59.69,19.05 60.96,20.32 NOREF#40.CMD
DAT: length 33
  Inner1 w0.254: NOREF#97.DAT 55.88,1.91 54.61,0.63 31.43,0.63 NOREF#60.PF7
I0: length 38.9
  Bottom Layer w0.254: NOREF#20.I0 52.07,3.18 39.37,3.18 38.74,3.81 38.74,20.95 39.37,21.59 39.37,25.4 38.42,26.35 NOREF#72.I0
I1: length 36.2
  Inner1 w0.254: NOREF#43.I1 52.07,5.72 39.37,5.72 38.74,6.35 38.74,20.95 39.37,21.59 39.37,25.08 NOREF#77.I1
I2: length 28.4
  Inner1 w0.254: NOREF#61.I2 44.77,27.94 47.62,27.94 49.53,26.03 49.53,10.8 NOREF#75.I2
I3: length 21.5
  Top Layer w0.254: NOREF#59.I3 48.26,26.35 49.53,25.08 49.53,13.34 NOREF#2.I3
I4: length 33.9
  Inner1 w0.254: NOREF#66.I4 40,31.43 50.8,31.43 52.07,30.16 52.07,13.34 NOREF#26.I4
I5: length 28.8
  Top Layer w0.254: NOREF#36.I5 52.07,15.88 52.07,30.16 50.8,31.43 42.55,31.43 NOREF#29.I5
I6: length 23.7
  Inner2 w0.254: NOREF#65.I6 52.07,18.42 52.07,30.16 50.8,31.43 45.09,31.43 NOREF#17.I6
I7: length 16
  Bottom Layer w0.254: NOREF#16.I7 50.8,29.53 52.07,28.26 52.07,20.95 NOREF#19.I7
MISO: length 42.9
  Top Layer w0.254: v1(58.42,10.16) 59.69,11.43 59.69,21.91 NOREF#82.MISO
  Inner2 w0.254: v1(58.42,10.16) 53.97,5.72 38.74,5.72 38.1,6.35 33.97,6.35 NOREF#95.MISO
MOSI: length 46.6
  Inner1 w0.254: NOREF#80.MOSI 62.23,21.91 62.23,8.89 60.96,7.62 55.88,7.62 54.61,6.35 54.61,3.81 53.97,3.18 36.51,3.18 NOREF#32.MOSI
O0: length 34.8
  Top Layer w0.254: R75/O0.1 v1(38.1,1.91)
  Bottom Layer w0.254: v1(38.1,1.91) 36.19,3.81 36.19,23.5 36.83,24.13 36.83,32.07 NOREF#74.O0
O1: length 32.6
  Top Layer w0.254: R75/O1.1 39.89,5.2 v1(38.1,6.98)
  Inner1 w0.254: v1(38.1,6.98) 36.19,8.89 36.19,23.5 36.83,24.13 36.83,30.16 38.1,31.43 38.74,31.43 NOREF#83.O1
O2: length 29
  Top Layer w0.254: R75/O2.1 39.89,7.74 38.74,8.89 38.74,20.95 39.37,21.59 39.37,30.16 40.64,31.43 41.28,31.43 NOREF#99.O2
O3: length 30.1
  Top Layer w0.254: R75/O3.1 39.89,10.28 v1(39.37,10.8) ; v1(37.47,12.7) v1(37.47,17.78)
  Inner2 w0.254: NOREF#50.O3 43.81,31.43 40.64,31.43 39.37,30.16 39.37,21.59 38.74,20.95 38.74,19.05 v1(37.47,17.78) ; v1(39.37,10.8) v1(37.47,12.7)
O4: length 26.1
  Top Layer w0.254: R75/O4.1 39.89,12.82 v1(39.37,13.34)
  Inner2 w0.254: v1(39.37,13.34) 36.19,16.51 36.19,23.5 36.83,24.13 36.83,34.61 NOREF#87.O4
O5: length 41.4
  Top Layer w0.254: R75/O5.1 39.89,15.12 v1(40.64,15.88)
  Inner1 w0.254: v1(40.64,15.88) 46.36,15.88 46.99,16.51 46.99,20.32 46.04,21.27 43.18,21.27 41.91,22.54 v1(41.91,25.72)
  Inner2 w0.254: v1(41.91,25.72) 41.91,27.31 42.55,27.94 46.36,27.94 47.62,29.21 v1(47.62,30.48)
  Bottom Layer w0.254: NOREF#25.O5 41.91,34.61 46.36,34.61 47.62,33.34 v1(47.62,30.48)
O6: length 29.3
  Top Layer w0.254: v1(40.64,18.42) 39.89,17.66 R75/O6.1 ; v1(48.9,32.39) 48.9,33.34 47.62,34.61 44.45,34.61 NOREF#57.O6 ; v1(48.9,30.48) 46.36,27.94 45.09,27.94 44.45,27.31 v1(44.45,25.72)
  Bottom Layer w0.254: v1(48.9,32.39) v1(48.9,30.48) ; v1(40.64,18.42) 43.81,18.42 44.45,19.05 v1(44.45,25.72)
O7: length 26.9
  Top Layer w0.254: R75/O7.1 39.89,20.2 v1(40.96,21.27)
  Inner2 w0.254: v1(40.96,21.27) 45.72,21.27 46.99,22.54 46.99,27.31 v1(50.17,30.48)
  Bottom Layer w0.254: v1(50.17,30.48) 50.17,34.61 48.9,35.88 NOREF#55.O7
RST: length 87.5
  Top Layer w0.254: NOREF#73.RST 14.92,4.76 17.46,7.3 30.48,7.3 35.56,12.38 35.56,15.88 v1(36.83,17.15)
  Inner1 w0.254: v1(39.37,15.88) 40.64,14.61 42.55,14.61 43.81,13.34 46.36,13.34 v1(47.62,12.06) ; NOREF#28.MAXRST 44.45,37.15 53.34,37.15 54.61,35.88 54.61,11.43 53.97,10.8 52.07,10.8 v1(51.44,10.16)
  Inner2 w0.254: v1(36.83,17.15) 38.1,17.15 v1(39.37,15.88)
  Bottom Layer w0.254: v1(47.62,12.06) 49.53,10.16 v1(51.44,10.16)
SCLK: length 42.3
  Inner2 w0.254: NOREF#54.SCLK 33.34,8.26 53.97,8.26 57.15,11.43 57.15,21.59 58.42,22.86 NOREF#6.SCLK
SEL: length 54.4
  Bottom Layer w0.254: NOREF#67.SEL 55.56,20.64 54.61,19.69 54.61,1.27 53.97,0.63 26.35,0.63 NOREF#18.PF5
SS: length 46.6
  Top Layer w0.254: NOREF#51.SS 66.04,22.86 64.77,21.59 64.77,7.62 63.5,6.35 v1(58.42,6.35)
  Inner2 w0.254: NOREF#31.SS 39.05,3.18 53.97,3.18 54.61,3.81 54.61,5.08 55.88,6.35 v1(58.42,6.35)
$1N889: length 1.6
  Top Layer w0.254: R75/O0.2 O0.2
$1N1284: length 1.6
  Top Layer w0.254: R75/O1.2 O1.2
$1N1447: length 1.6
  Top Layer w0.254: R75/O2.2 O2.2
$1N1536: length 1.6
  Top Layer w0.254: R75/O3.2 O3.2
$1N1627: length 1.6
  Top Layer w0.254: R75/O4.2 O4.2
$1N1720: length 1.6
  Top Layer w0.254: R75/O5.2 O5.2
$1N1815: length 1.6
  Top Layer w0.254: R75/O6.2 O6.2
$1N1912: length 1.6
  Top Layer w0.254: R75/O7.2 O7.2

## Text on the board
Top Silkscreen Layer: OUT- | PD3 | PD2 | GND | PD1 | PD0 | PD4 | PC6 | PD7 | PE6 | VIN- | PB4 | PB5 | I4 | I0 | I5 | I1 | I6 | I2 | I7 | I3 | VCC | DAT | SCLK | ACK | MISO | 7V | MOSI | SS | OUT+ | RAW | RST | PF4 | PF5 | PF6 | PF7 | PB1 | PB3 | VIN+ | PB2 | PB6 | O4 | O0 | O5 | O1 | MAX_RST | O6 | O2 | O7 | O3 | SEL | CLK | CMD | VBUS | 8 | 7 | 6 | 5 | 4 | 3 | 2 | 1 | [VKLSVAN]MT3608 | ORECON Rev1.0 | [SparkFun]Pro Micro | USB mini v2.0 | PS Controller | DIP SW

# Board 1:Sub - PS Controller
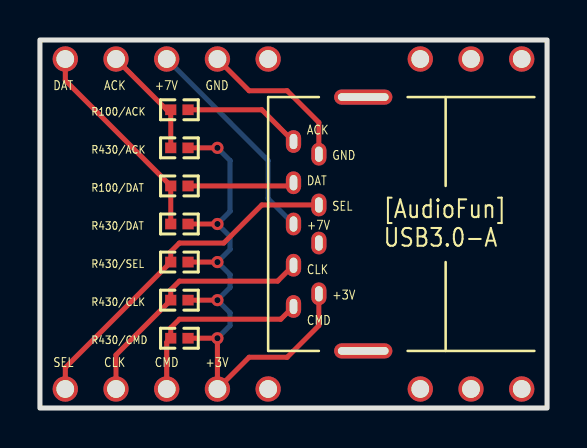
[diagram p4: board, top side]
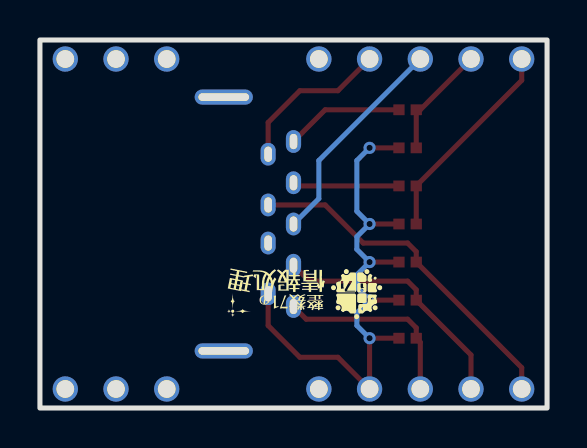
[diagram p5: board, bottom side, seen from below]

Outline 25.4 x 18.41 mm; copper layers: Top Layer, Bottom Layer. Coordinates in mm from the lower left corner of the outline.
Outline path: rectangle 0,18.41 25.4,0
Stack: Top Layer 0.035mm / Dielectric1 1.51mm FR4 er 4.5 / Bottom Layer 0.035mm

## Design rules (mm)
template: JLCPCB Capability(Two Layers Board)
spacing copperThickness1oz (default): track to track 0.102, other pairs 0.152 to 0.3
spacing copperThickness2oz: track to track 0.203, other pairs 0.152 to 0.3
track width copperThickness1oz (default): min 0.127, default 0.254, max 2.54
track width copperThickness2oz: min 0.203, default 0.254, max 2.54
differential pair differentialPair (default): width min 0.127, default 0.254, max 2.54; gap min 0.152, default 0.152
via viaSize (default): diameter min 0.5, default 0.61, max 10; hole min 0.3, default 0.305, max 6.3

## Placement (name value [footprint] x y rotation side)
NOREF  -  [Pad_e130]  3.81 17.46 0 top
NOREF#2  -  [Pad_e160]  8.89 17.46 0 top
NOREF#3  -  [Pad_e127]  1.27 17.46 0 top
NOREF#4  -  [Pad_e214]  12.7 13.33 0 top
NOREF#5  -  [Pad_e126]  1.27 0.95 0 top
NOREF#6  -  [Pad_e159]  8.89 0.95 0 top
NOREF#7  -  [Pad_e239]  24.13 0.95 0 top
NOREF#8  -  [Pad_e211]  12.7 11.27 0 top
NOREF#9  -  [Pad_e209]  12.7 7.14 0 top
NOREF#10  -  [Pad_e231]  19.05 17.46 0 top
NOREF#11  -  [Pad_e213]  12.7 9.21 0 top
NOREF#12  -  [Pad_e230]  19.05 0.95 0 top
NOREF#13  -  [Pad_e201]  11.43 17.46 0 top
NOREF#14  -  [Pad_e138]  6.35 0.95 0 top
NOREF#15  -  [Pad_e226]  16.19 2.86 0 top
NOREF#16  -  [Pad_e235]  21.59 17.46 0 top
NOREF#17  -  [Pad_e240]  24.13 17.46 0 top
NOREF#18  -  [Pad_e225]  13.97 10.16 0 top
NOREF#19  -  [Pad_e210]  12.7 5.08 0 top
NOREF#20  -  [Pad_e221]  13.97 5.71 0 top
NOREF#21  -  [Pad_e220]  13.97 8.25 0 top
NOREF#22  -  [Pad_e227]  16.19 15.56 0 top
NOREF#23  -  [Pad_e237]  21.59 0.95 0 top
NOREF#24  -  [Pad_e222]  13.97 12.7 0 top
NOREF#25  -  [Pad_e131]  3.81 0.95 0 top
NOREF#26  -  [Pad_e198]  11.43 0.95 0 top
NOREF#27  -  [Pad_e139]  6.35 17.46 0 top
R100/ACK  100Ω  [R0402]  6.98 14.92 180 top
R100/DAT  100Ω  [R0402]  6.98 11.11 180 top
R430/ACK  430Ω  [R0402]  6.98 13.02 0 top
R430/CLK  430Ω  [R0402]  6.98 5.4 0 top
R430/CMD  430Ω  [R0402]  6.98 3.49 0 top
R430/DAT  430Ω  [R0402]  6.98 9.21 0 top
R430/SEL  430Ω  [R0402]  6.98 7.3 0 top

## Footprints (pads in the part's own frame, mm; a bottom-side part is the same pattern mirrored in y, then rotated)
Pad_e126
  round 1.27 hole 0.889: SEL(0,0)
Pad_e127
  round 1.27 hole 0.889: DAT(0,0)
Pad_e130
  round 1.27 hole 0.889: ACK(0,0)
Pad_e131
  round 1.27 hole 0.889: CLK(0,0)
Pad_e138
  round 1.27 hole 0.889: CMD(0,0)
Pad_e139
  round 1.27 hole 0.889: 7V(0,0)
Pad_e159
  round 1.27 hole 0.889: VCC(0,0)
Pad_e160
  round 1.27 hole 0.889: GND(0,0)
Pad_e198
  round 1.27 hole 0.889: NONE(0,0)
Pad_e201
  round 1.27 hole 0.889: NONE(0,0)
Pad_e209
  rrect 0.762x1.143 hole 0.381x0.762: CLK(0,0)
Pad_e210
  rrect 0.762x1.143 hole 0.381x0.762: CMD(0,0)
Pad_e211
  rrect 0.762x1.143 hole 0.381x0.762: DAT(0,0)
Pad_e213
  rrect 0.762x1.143 hole 0.381x0.762: 7V(0,0)
Pad_e214
  rrect 0.762x1.143 hole 0.381x0.762: ACK(0,0)
Pad_e220
  rrect 0.762x1.143 hole 0.381x0.762: NONE(0,0)
Pad_e221
  rrect 0.762x1.143 hole 0.381x0.762: VCC(0,0)
Pad_e222
  rrect 0.762x1.143 hole 0.381x0.762: GND(0,0)
Pad_e225
  rrect 0.762x1.143 hole 0.381x0.762: SEL(0,0)
Pad_e226
  rrect 2.921x0.762 hole 2.54x0.381: FG(0,0)
Pad_e227
  rrect 2.921x0.762 hole 2.54x0.381: FG(0,0)
Pad_e230
  round 1.27 hole 0.889: NONE(0,0)
Pad_e231
  round 1.27 hole 0.889: NONE(0,0)
Pad_e235
  round 1.27 hole 0.889: NONE(0,0)
Pad_e237
  round 1.27 hole 0.889: NONE(0,0)
Pad_e239
  round 1.27 hole 0.889: NONE(0,0)
Pad_e240
  round 1.27 hole 0.889: NONE(0,0)
R0402
  rect 0.566x0.54 smd: 1(-0.433,0) 2(0.433,0)

## Nets
+3.3V: NOREF#6.VCC NOREF#20.VCC R430/ACK.2 R430/CLK.2 R430/CMD.2 R430/DAT.2 R430/SEL.2
+7V: NOREF#11.7V NOREF#27.7V
GND: NOREF#2.GND NOREF#24.GND
ACK: NOREF#4.ACK R100/ACK.1
ACK/R: NOREF.ACK R100/ACK.2 R430/ACK.1
CLK: NOREF#9.CLK NOREF#25.CLK R430/CLK.1
CMD: NOREF#14.CMD NOREF#19.CMD R430/CMD.1
DAT: NOREF#8.DAT R100/DAT.1
DAT/R: NOREF#3.DAT R100/DAT.2 R430/DAT.1
SEL: NOREF#5.SEL NOREF#18.SEL R430/SEL.1

Pads without a net: NOREF#7 NONE; NOREF#10 NONE; NOREF#12 NONE; NOREF#13 NONE; NOREF#15 FG; NOREF#16 NONE; NOREF#17 NONE; NOREF#21 NONE; NOREF#22 FG; NOREF#23 NONE; NOREF#26 NONE

## Via types
v1: diameter 0.61, hole 0.305, Top Layer to Bottom Layer, 5 vias

## Routing (per net, layer and track width the routed paths; a pad name or vN(x,y) marks a point on that pad's centre or on a via; arc(x,y) is an arc through that point)
+3.3V: length 29.5
  Top Layer w0.254: v1(8.89,13.02) R430/ACK.2 ; v1(8.89,5.4) R430/CLK.2 ; v1(8.89,9.21) R430/DAT.2 ; v1(8.89,7.3) R430/SEL.2 ; NOREF#20.VCC 13.97,4.13 12.38,2.54 10.48,2.54 NOREF#6.VCC v1(8.89,3.49) R430/CMD.2
  Bottom Layer w0.254: v1(8.89,13.02) 9.52,12.38 9.52,9.84 v1(8.89,9.21) 9.52,8.57 9.52,7.94 v1(8.89,7.3) 9.52,6.67 9.52,6.03 v1(8.89,5.4) 9.52,4.76 9.52,4.13 v1(8.89,3.49)
+7V: length 10.9
  Bottom Layer w0.254: NOREF#27.7V 11.43,12.38 11.43,10.48 NOREF#11.7V
GND: length 8
  Top Layer w0.254: NOREF#24.GND 13.97,14.29 12.38,15.88 10.48,15.88 NOREF#2.GND
ACK: length 5.9
  Top Layer w0.254: R100/ACK.1 11.11,14.92 NOREF#4.ACK
ACK/R: length 5.7
  Top Layer w0.254: R430/ACK.1 R100/ACK.2 6.35,14.92 NOREF.ACK
CLK: length 12.8
  Top Layer w0.254: NOREF#9.CLK 11.91,6.35 6.98,6.35 6.55,5.92 R430/CLK.1 3.81,2.66 NOREF#25.CLK
CMD: length 9.7
  Top Layer w0.254: NOREF#14.CMD 6.35,3.29 R430/CMD.1 6.55,4.01 6.98,4.44 12.06,4.44 NOREF#19.CMD
DAT: length 5.3
  Top Layer w0.254: R100/DAT.1 12.54,11.11 NOREF#8.DAT
DAT/R: length 10.4
  Top Layer w0.254: NOREF#3.DAT 1.27,16.39 R100/DAT.2 R430/DAT.1
SEL: length 17.4
  Top Layer w0.254: NOREF#18.SEL 11.11,10.16 9.21,8.25 6.98,8.25 6.55,7.82 R430/SEL.1 1.27,2.02 NOREF#5.SEL

## Text on the board
Top Silkscreen Layer: SEL | CLK | CMD | +3V | DAT | ACK | +7V | GND | [AudioFun] / USB3.0-A
